# EAGLE design MCAT-CANYVAL-BOTTOM-5X (EAGLE 7.2.0)
DATECODE: 20150302102847; REV: 5X
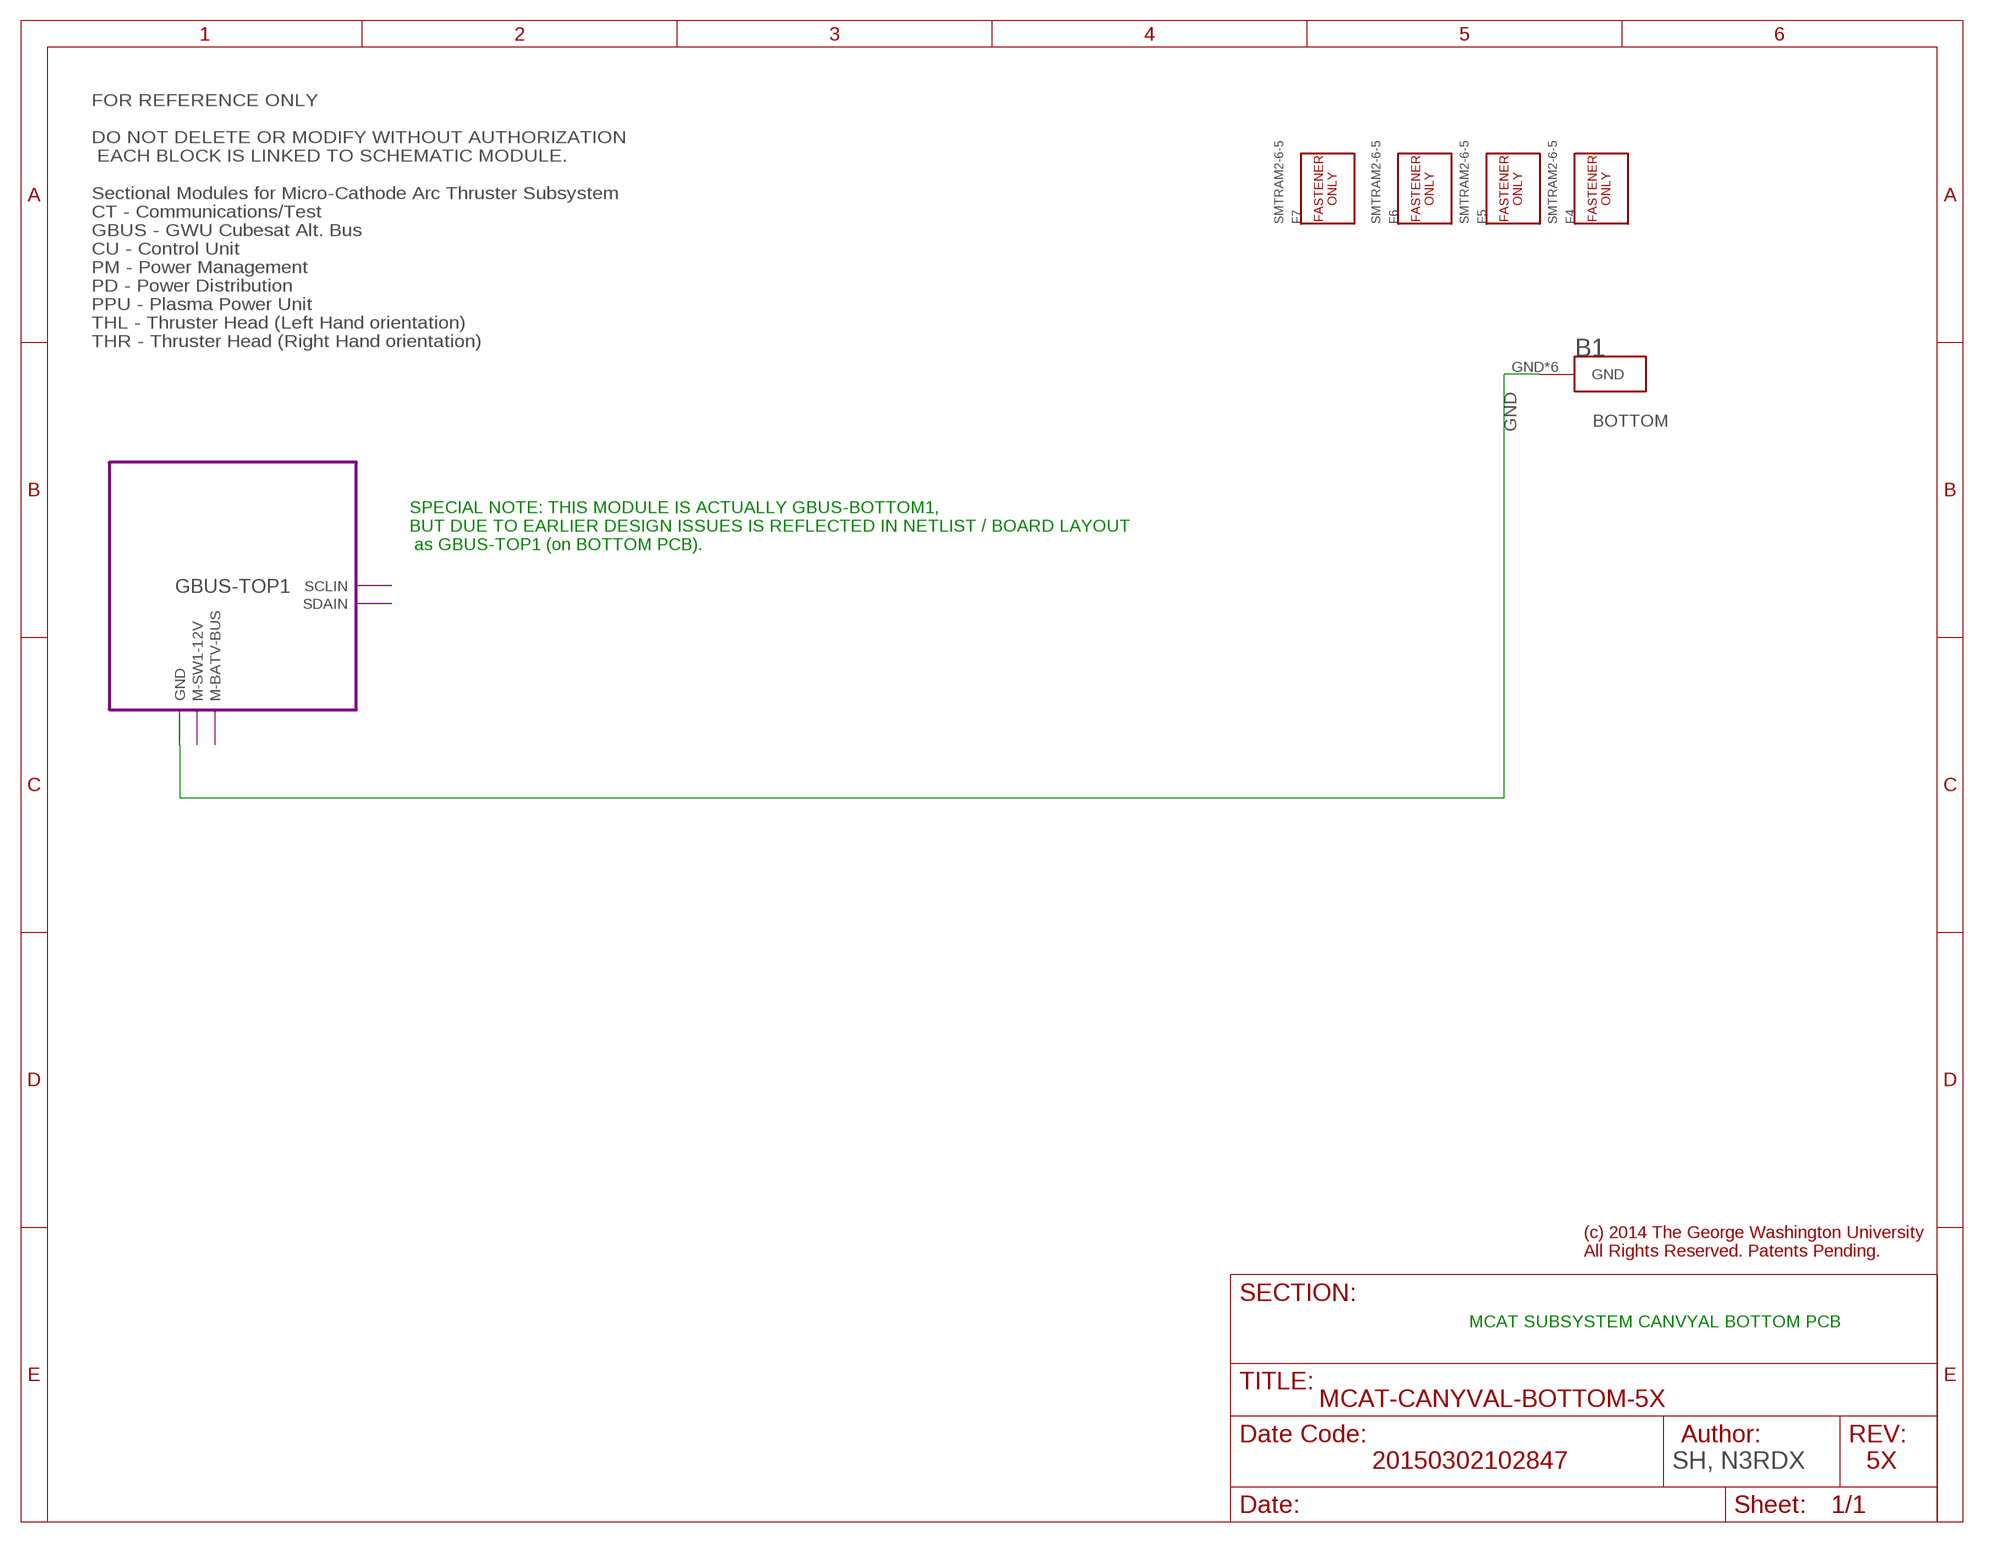
[diagram p0: schematic, sheet 1]

## Parts
B1  MCAT-4CU-C-PCB/BOTTOM  [MCAT-4CU-C-BOTTOM-V4-BLANK]
F4  SMTRAM2-6-5  [SMTRA-M2-6-5]
F5  SMTRAM2-6-5  [SMTRA-M2-6-5]
F6  SMTRAM2-6-5  [SMTRA-M2-6-5]
F7  SMTRAM2-6-5  [SMTRA-M2-6-5]

## Module instances
GBUS-TOP1 = GBUS-BOTTOM

## Nets
GND [3 A]: B1.GND B1.GND@1(GND) B1.GND@2(GND) B1.GND@3(GND) B1.GND@4(GND) B1.GND@13(GND) ; port GBUS-TOP1.GND

## Notes on the sheet
- FOR REFERENCE ONLY
  
  DO NOT DELETE OR MODIFY WITHOUT AUTHORIZATION
   EACH BLOCK IS LINKED TO SCHEMATIC MODULE.
  
  Sectional Modules for Micro-Cathode Arc Thruster Subsystem
  CT - Communications/Test
  GBUS - GWU Cubesat Alt. Bus
  CU - Control Unit
  PM - Power Management
  PD - Power Distribution
  PPU - Plasma Power Unit
  THL - Thruster Head (Left Hand orientation)
  THR - Thruster Head (Right Hand orientation)
- SPECIAL NOTE: THIS MODULE IS ACTUALLY GBUS-BOTTOM1, 
  BUT DUE TO EARLIER DESIGN ISSUES IS REFLECTED IN NETLIST / BOARD LAYOUT
   as GBUS-TOP1 (on BOTTOM PCB).
- MCAT SUBSYSTEM CANVYAL BOTTOM PCB
- SH, N3RDX

## Library data of the parts
B1 = gwu_mpnl_ucat_v10:MCAT-4CU-C-PCB; COPYRIGHT: (c) 2015, THE GEORGE WASHINGTON UNIVERSITY; PCBLABEL: BOTTOM
F4-F7 = gwu_mpnl_ucat_v10:SMTRA: Type SMTRA - ReelFast Surface Mount Right Angle (R'ANGLE) Fastener (Metric); MF: Penn Engineering; MPN: SMTRAM2-6-5-DT

## Module GBUS-BOTTOM
Ports: SCLIN(io) SDAIN(io) M-SW1-12V(io) M-BATV-BUS(io) GND(io)
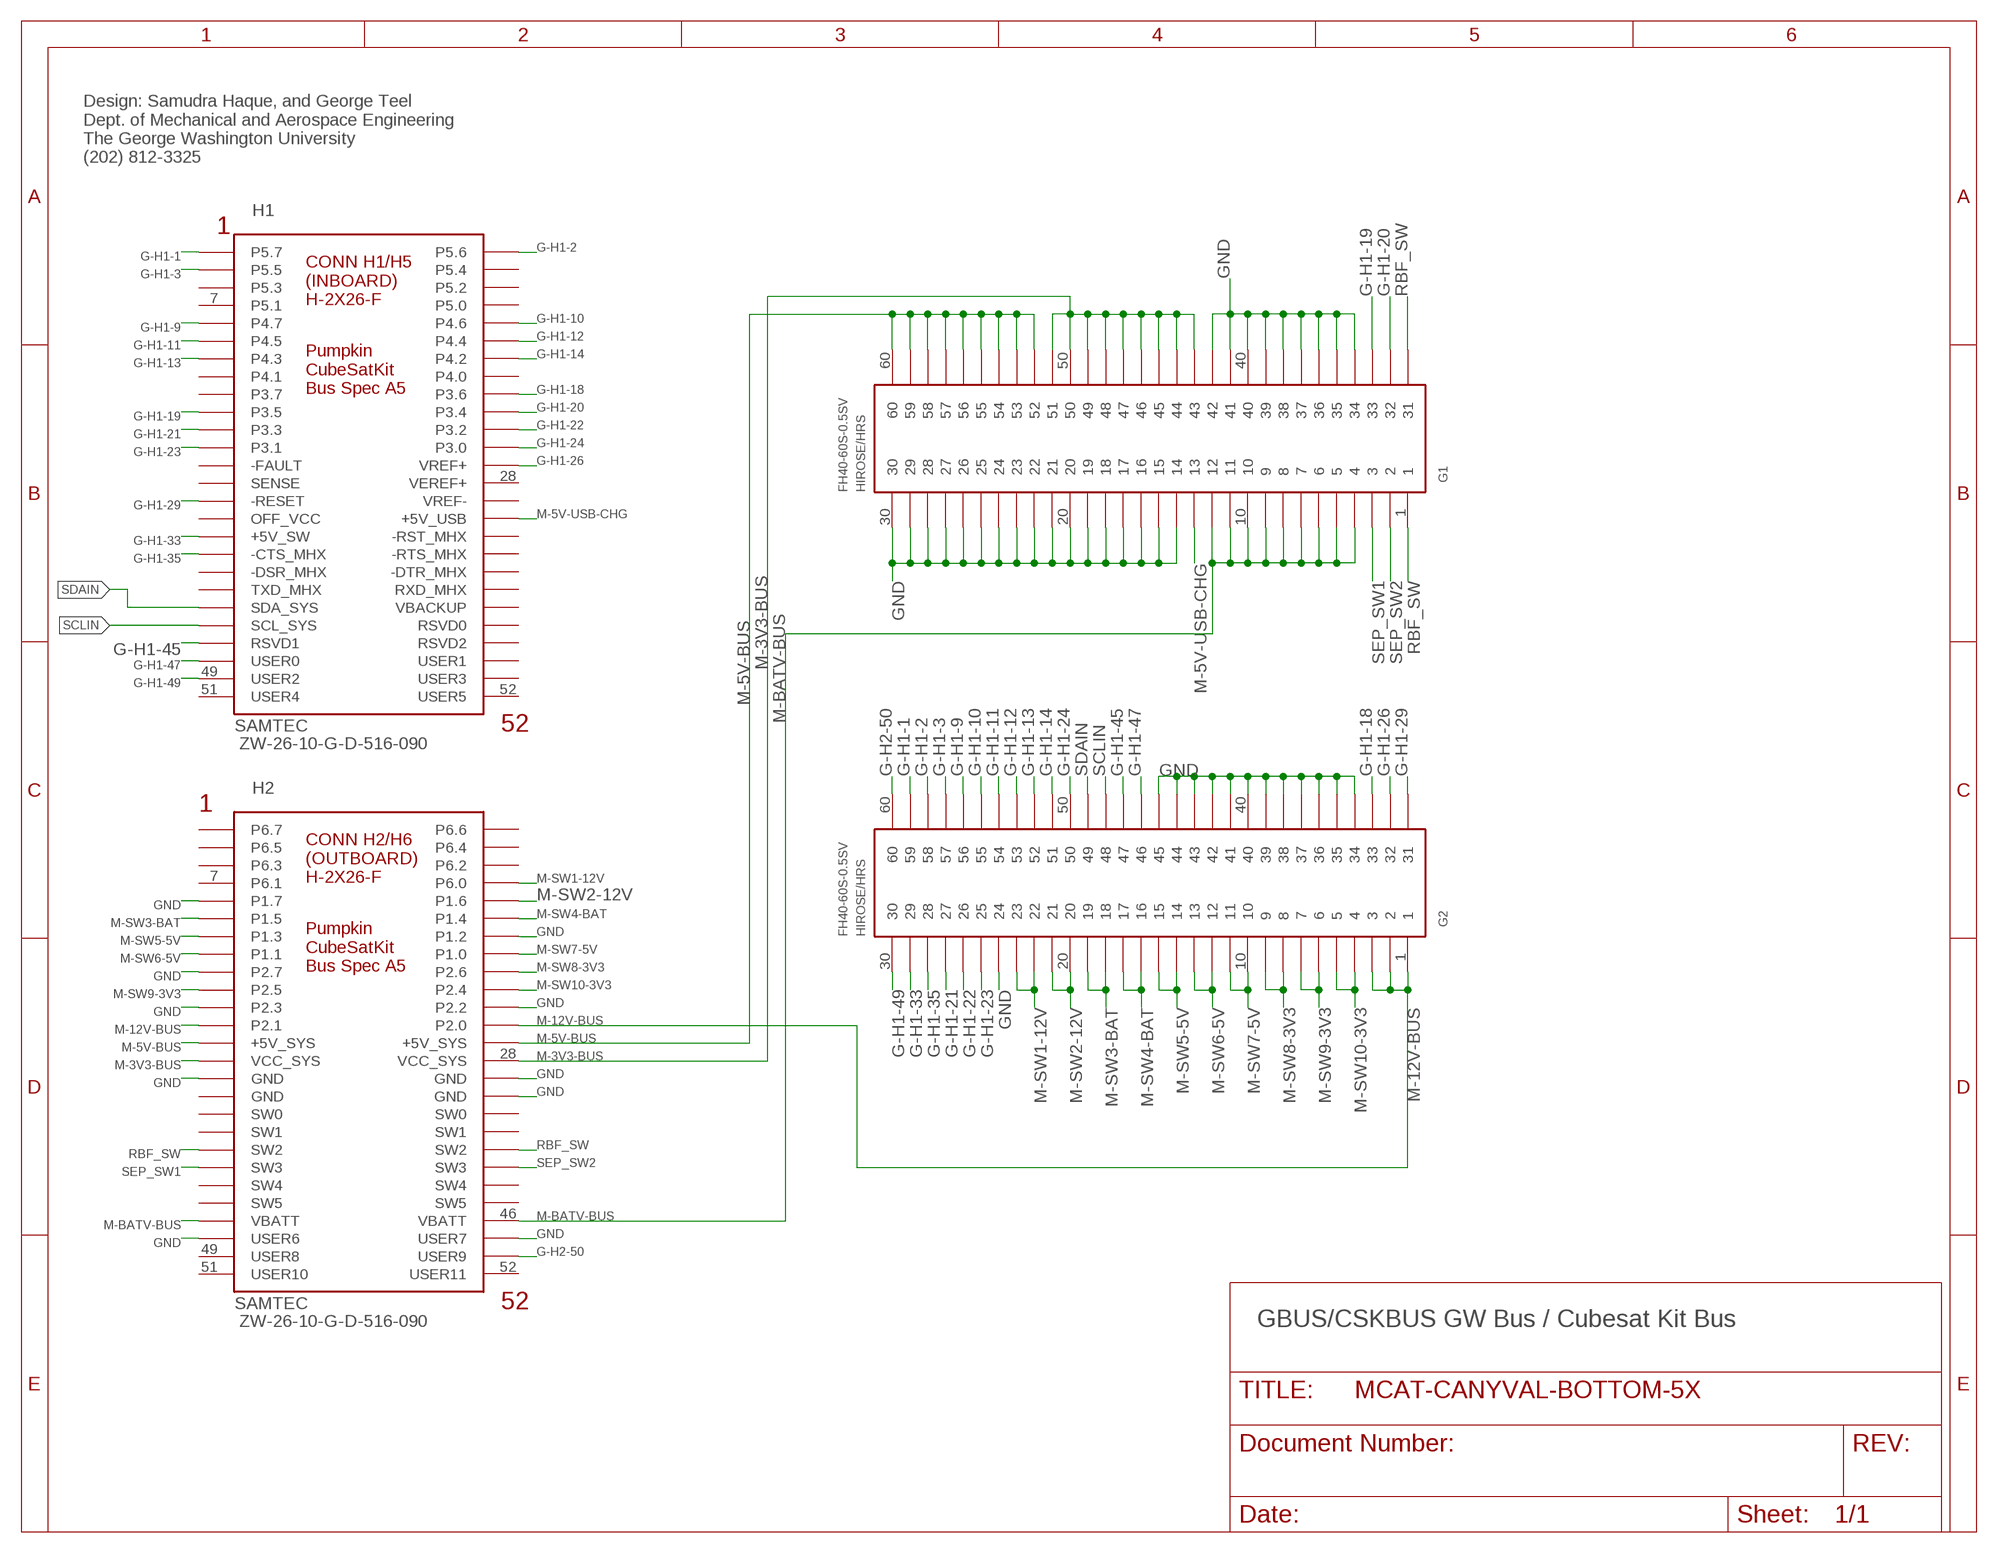
[diagram p1: schematic, module GBUS-BOTTOM, sheet 1]

### Parts
G1  HIROSE-FH40-60S-0.5SV  [HIROSE-FH40-60S-0.5SV]
G2  HIROSE-FH40-60S-0.5SV  [HIROSE-FH40-60S-0.5SV]
H1  H1-H5-INBOARD-CSK-BUS-CONN  [CONN-2X26X0.1-HDR]
H2  H2-H6-OUTBOARD-CSK-BUS-CONN  [CONN-2X26X0.1-HDR]

### Nets
G-H1-1 [1 A]: G2.59 H1.1(P5.7)
G-H1-2 [1 A]: G2.58 H1.2(P5.6)
G-H1-3 [1 A]: G2.57 H1.3(P5.5)
G-H1-9 [1 A]: G2.56 H1.9(P4.7)
G-H1-10 [1 A]: G2.55 H1.10(P4.6)
G-H1-11 [1 A]: G2.54 H1.11(P4.5)
G-H1-12 [1 A]: G2.53 H1.12(P4.4)
G-H1-13 [1 A]: G2.52 H1.13(P4.3)
G-H1-14 [1 A]: G2.51 H1.14(P4.2)
G-H1-18: G2.33 H1.18(P3.6)
G-H1-19 [1 A]: G1.33 H1.19(P3.5)
G-H1-20 [1 A]: G1.32 H1.20(P3.4)
G-H1-21 [1 A]: G2.27 H1.21(P3.3)
G-H1-22 [1 A]: G2.26 H1.22(P3.2)
G-H1-23 [1 A]: G2.25 H1.23(P3.1)
G-H1-24 [1 A]: G2.50 H1.24(P3.0)
G-H1-26: G2.32 H1.26(VREF+)
G-H1-29: G2.31 H1.29(-RESET)
G-H1-33 [1 A]: G2.29 H1.33(+5V_SW)
G-H1-35 [1 A]: G2.28 H1.35(-CTS_MHX)
G-H1-45 [1 A]: G2.47 H1.45(RSVD1)
G-H1-47 [1 A]: G2.46 H1.47(USER0)
G-H1-49 [1 A]: G2.30 H1.49(USER2)
G-H2-50 [1 A]: G2.60 H2.50(USER9)
GND: G1.14 G1.15 G1.16 G1.17 G1.18 G1.19 G1.20 G1.21 G1.22 G1.23 G1.24 G1.25 G1.26 G1.27 G1.28 G1.29 G1.30 G1.34 G1.35 G1.36 G1.37 G1.38 G1.39 G1.40 G1.41 G1.42 G2.24 G2.34 G2.35 G2.36 G2.37 G2.38 G2.39 G2.40 G2.41 G2.42 G2.43 G2.44 G2.45 H2.9(P1.7) H2.14(P1.2) H2.17(P2.7) H2.21(P2.3) H2.22(P2.2) H2.29(GND) H2.30(GND) H2.32(GND) H2.47(USER6) H2.48(USER7)
M-3V3-BUS [3 A]: G1.43 G1.44 G1.45 G1.46 G1.47 G1.48 G1.49 G1.50 G1.51 H2.27(VCC_SYS) H2.28(VCC_SYS)
M-5V-BUS [3 A]: G1.52 G1.53 G1.54 G1.55 G1.56 G1.57 G1.58 G1.59 G1.60 H2.25(+5V_SYS) H2.26(+5V_SYS)
M-5V-USB-CHG: G1.13 H1.32(+5V_USB)
M-12V-BUS [2 A]: G2.1 G2.2 G2.3 H2.23(P2.1) H2.24(P2.0)
M-BATV-BUS [3 A]: G1.4 G1.5 G1.6 G1.7 G1.8 G1.9 G1.10 G1.11 G1.12 H2.45(VBATT) H2.46(VBATT)
M-SW1-12V [1 A]: G2.22 G2.23 H2.8(P6.0)
M-SW2-12V [1 A]: G2.20 G2.21 H2.10(P1.6)
M-SW3-BAT [1 A]: G2.18 G2.19 H2.11(P1.5)
M-SW4-BAT [1 A]: G2.16 G2.17 H2.12(P1.4)
M-SW5-5V [1 A]: G2.14 G2.15 H2.13(P1.3)
M-SW6-5V [1 A]: G2.12 G2.13 H2.15(P1.1)
M-SW7-5V [1 A]: G2.10 G2.11 H2.16(P1.0)
M-SW8-3V3 [1 A]: G2.8 G2.9 H2.18(P2.6)
M-SW9-3V3 [1 A]: G2.6 G2.7 H2.19(P2.5)
M-SW10-3V3 [1 A]: G2.4 G2.5 H2.20(P2.4)
RBF_SW [1 A]: G1.1 G1.31 H2.37(SW2) H2.38(SW2)
SCLIN [1 A]: G2.48 H1.43(SCL_SYS)
SDAIN [1 A]: G2.49 H1.41(SDA_SYS)
SEP_SW1 [1 A]: G1.3 H2.39(SW3)
SEP_SW2 [1 A]: G1.2 H2.40(SW3)
Unconnected: H1.4(P5.4) H1.5(P5.3) H1.6(P5.2) H1.7(P5.1) H1.8(P5.0) H1.15(P4.1) H1.16(P4.0) H1.17(P3.7) H1.25(-FAULT) H1.27(SENSE) H1.28(VEREF+) H1.30(VREF-) H1.31(OFF_VCC) H1.34(-RST_MHX) H1.36(-RTS_MHX) H1.37(-DSR_MHX) H1.38(-DTR_MHX) H1.39(TXD_MHX) H1.40(RXD_MHX) H1.42(VBACKUP) H1.44(RSVD0) H1.46(RSVD2) H1.48(USER1) H1.50(USER3) H1.51(USER4) H1.52(USER5) H2.1(P6.7) H2.2(P6.6) H2.3(P6.5) H2.4(P6.4) H2.5(P6.3) H2.6(P6.2) H2.7(P6.1) H2.31(GND) H2.33(SW0) H2.34(SW0) H2.35(SW1) H2.36(SW1) H2.41(SW4) H2.42(SW4) H2.43(SW5) H2.44(SW5) H2.49(USER8) H2.51(USER10) H2.52(USER11)

### Notes on the sheet
- Design: Samudra Haque, and George Teel
  Dept. of Mechanical and Aerospace Engineering
  The George Washington University
  (202) 812-3325
- GBUS/CSKBUS GW Bus / Cubesat Kit Bus

### Library data of the parts
G1 = gwu_mpnl_ucat_v10:HIROSE-FH40-60S-0.5SV; MF: HIROSE/HRS; MPN: FH40-60S-0.5SV; PCBLABEL: G1
G2 = gwu_mpnl_ucat_v10:HIROSE-FH40-60S-0.5SV; MF: HIROSE/HRS; MPN: FH40-60S-0.5SV; PCBLABEL: G2
H1 = gwu_mpnl_ucat_v10:H1-H5-INBOARD-CSK-BUS-CONN: H1/H5/Inboard Cubesat Kit Bus Connector 1 x Samtec ESQ-126-39-G-D Connectors 104 pins per Cubesat Kit Bus Spec A5 Place H1/H5 (Inboard) conn. pin #1 at 3.275"x0.550" exactly. Pins 1-52; MF: SAMTEC; MPN: ZW-26-10-G-D-516-090; PCBLABEL: H1
H2 = gwu_mpnl_ucat_v10:H2-H6-OUTBOARD-CSK-BUS-CONN; MF: SAMTEC; MPN: ZW-26-10-G-D-516-090; PCBLABEL: H2

## Net classes
1 vout1a2ozcu: width 0.406 mm
2 VOUTA-2A-CKT: width 1.016 mm
3 P3-0.5A-CKT: width 0.254 mm
5 25 mA: width 0.002 mm
6 0.1 A: width 0.011 mm
7 0.25 A: width 0.039 mm
8 0.5 A: width 0.101 mm
9 1 A: width 0.263 mm
10 2 A: width 0.685 mm
11 3 A: width 1.199 mm

## Board
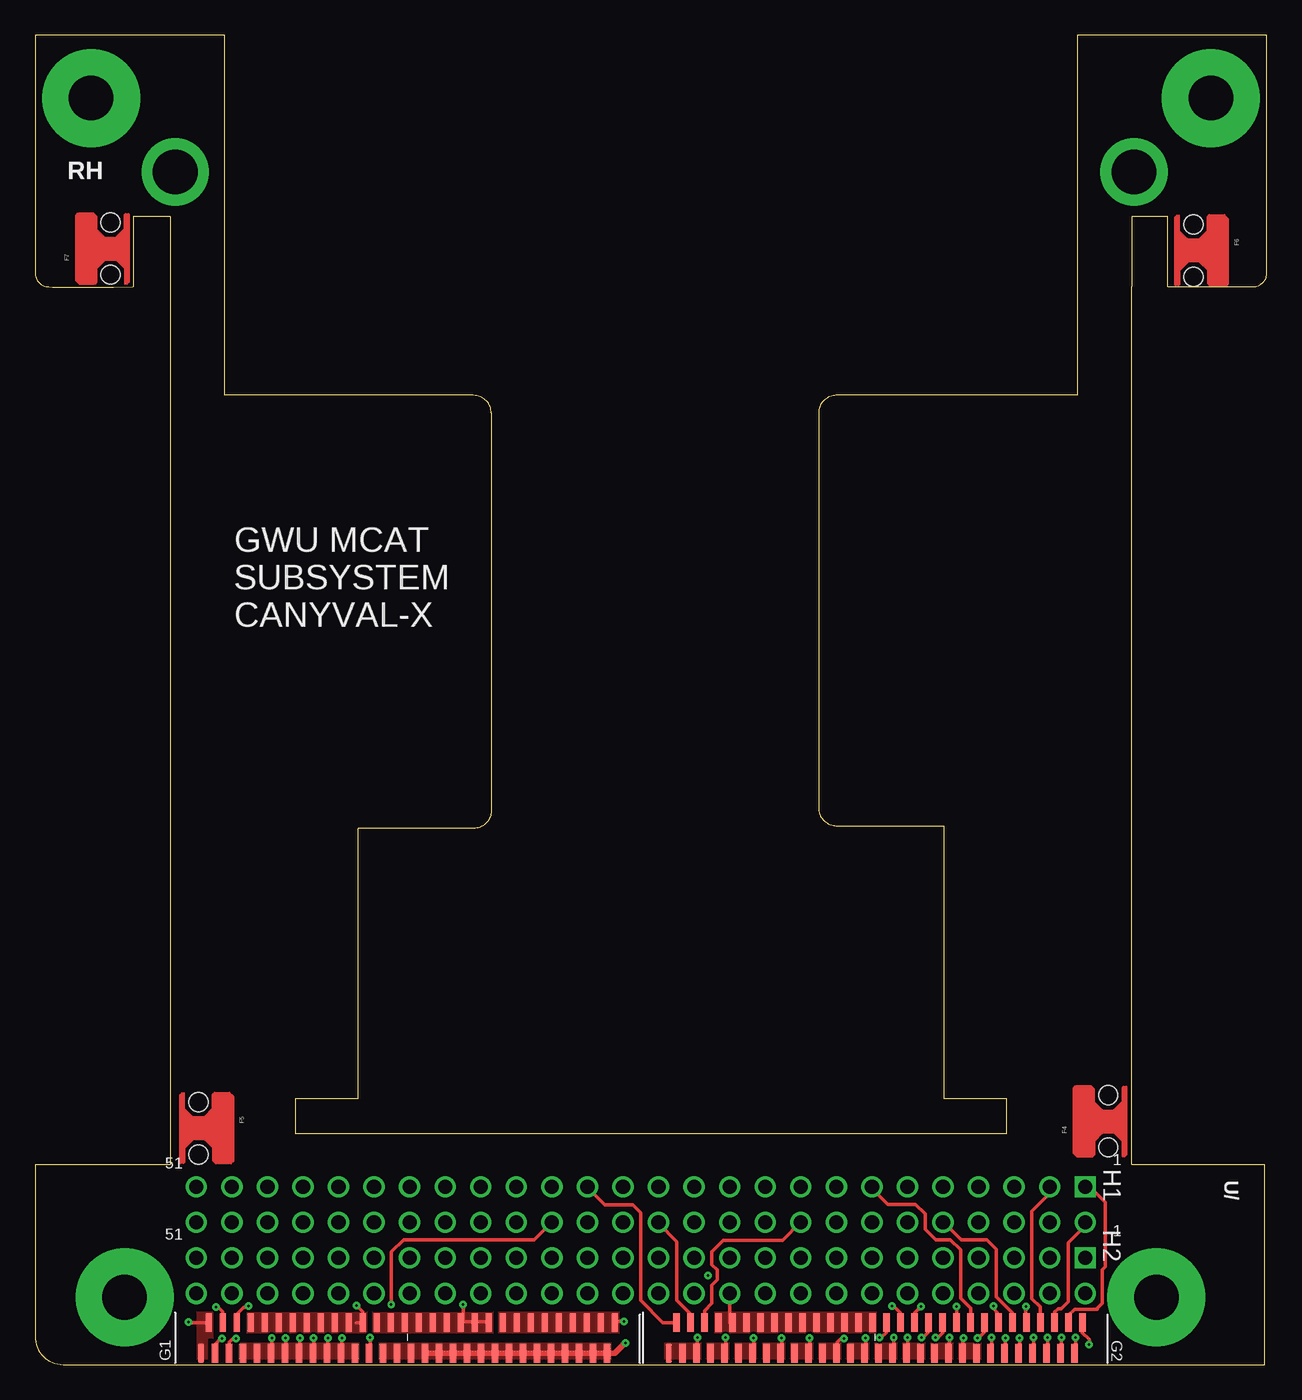
[diagram p2: board, top side]
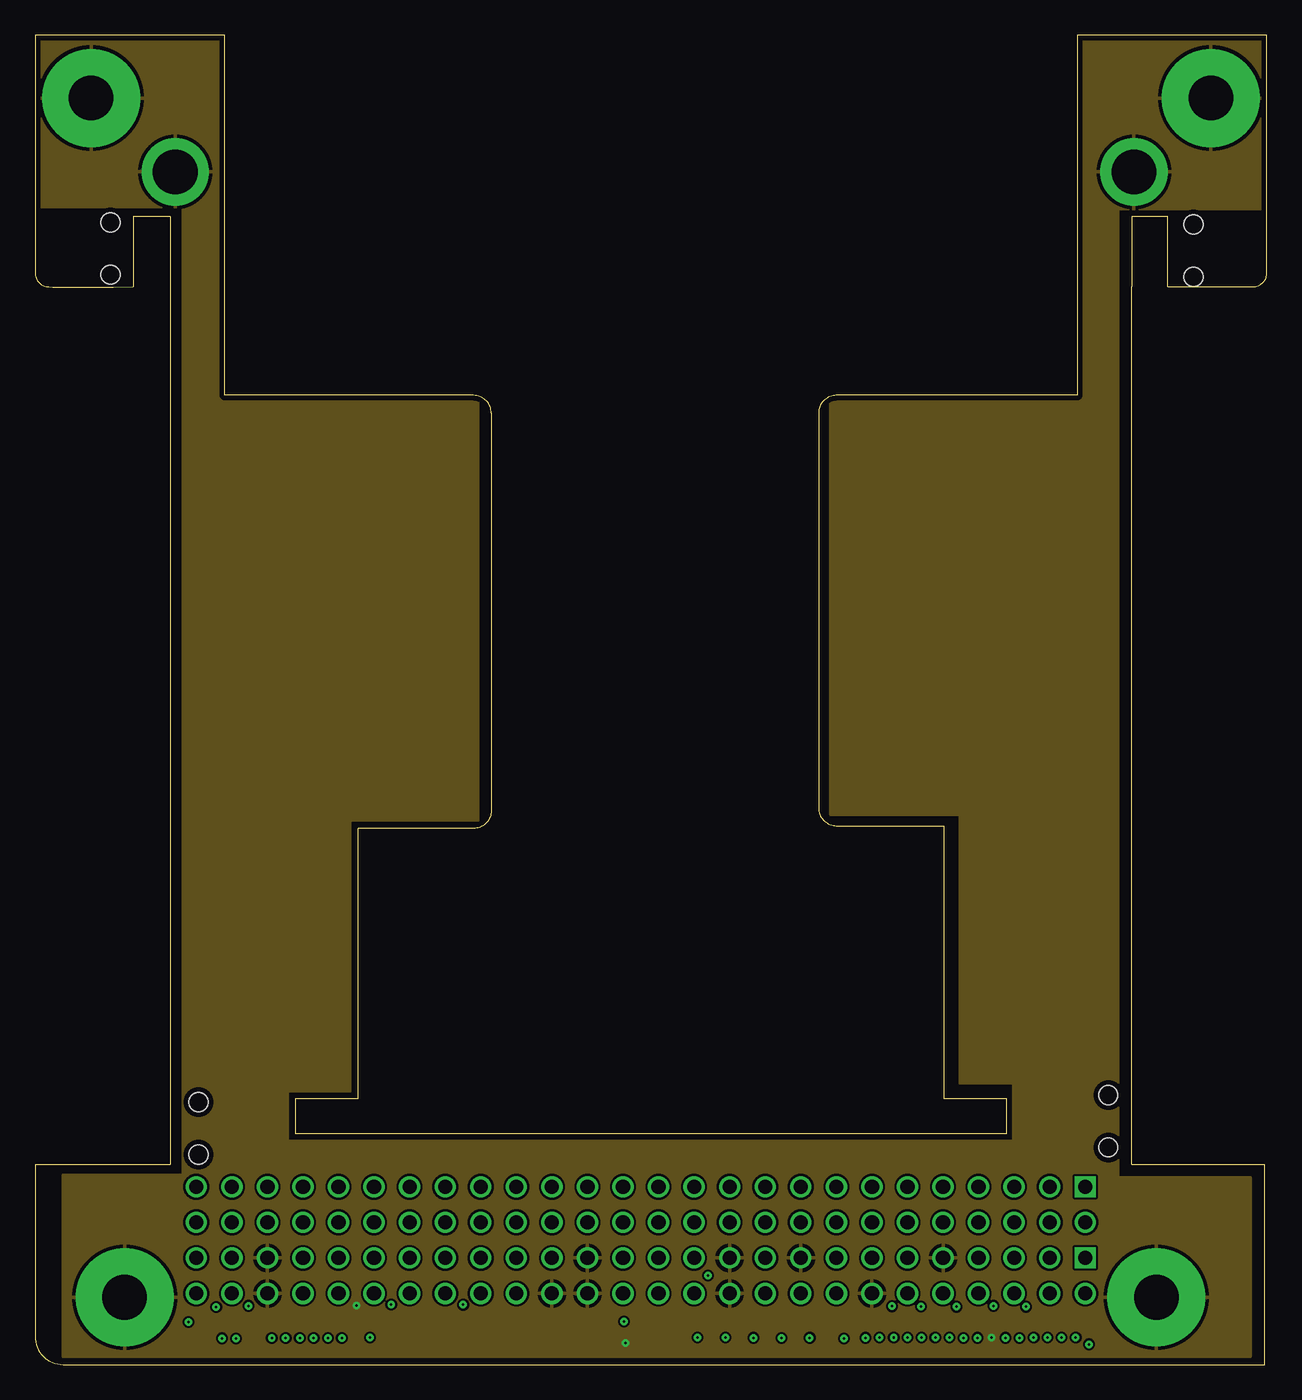
[diagram p3: board, inner layer L2/TopGround]
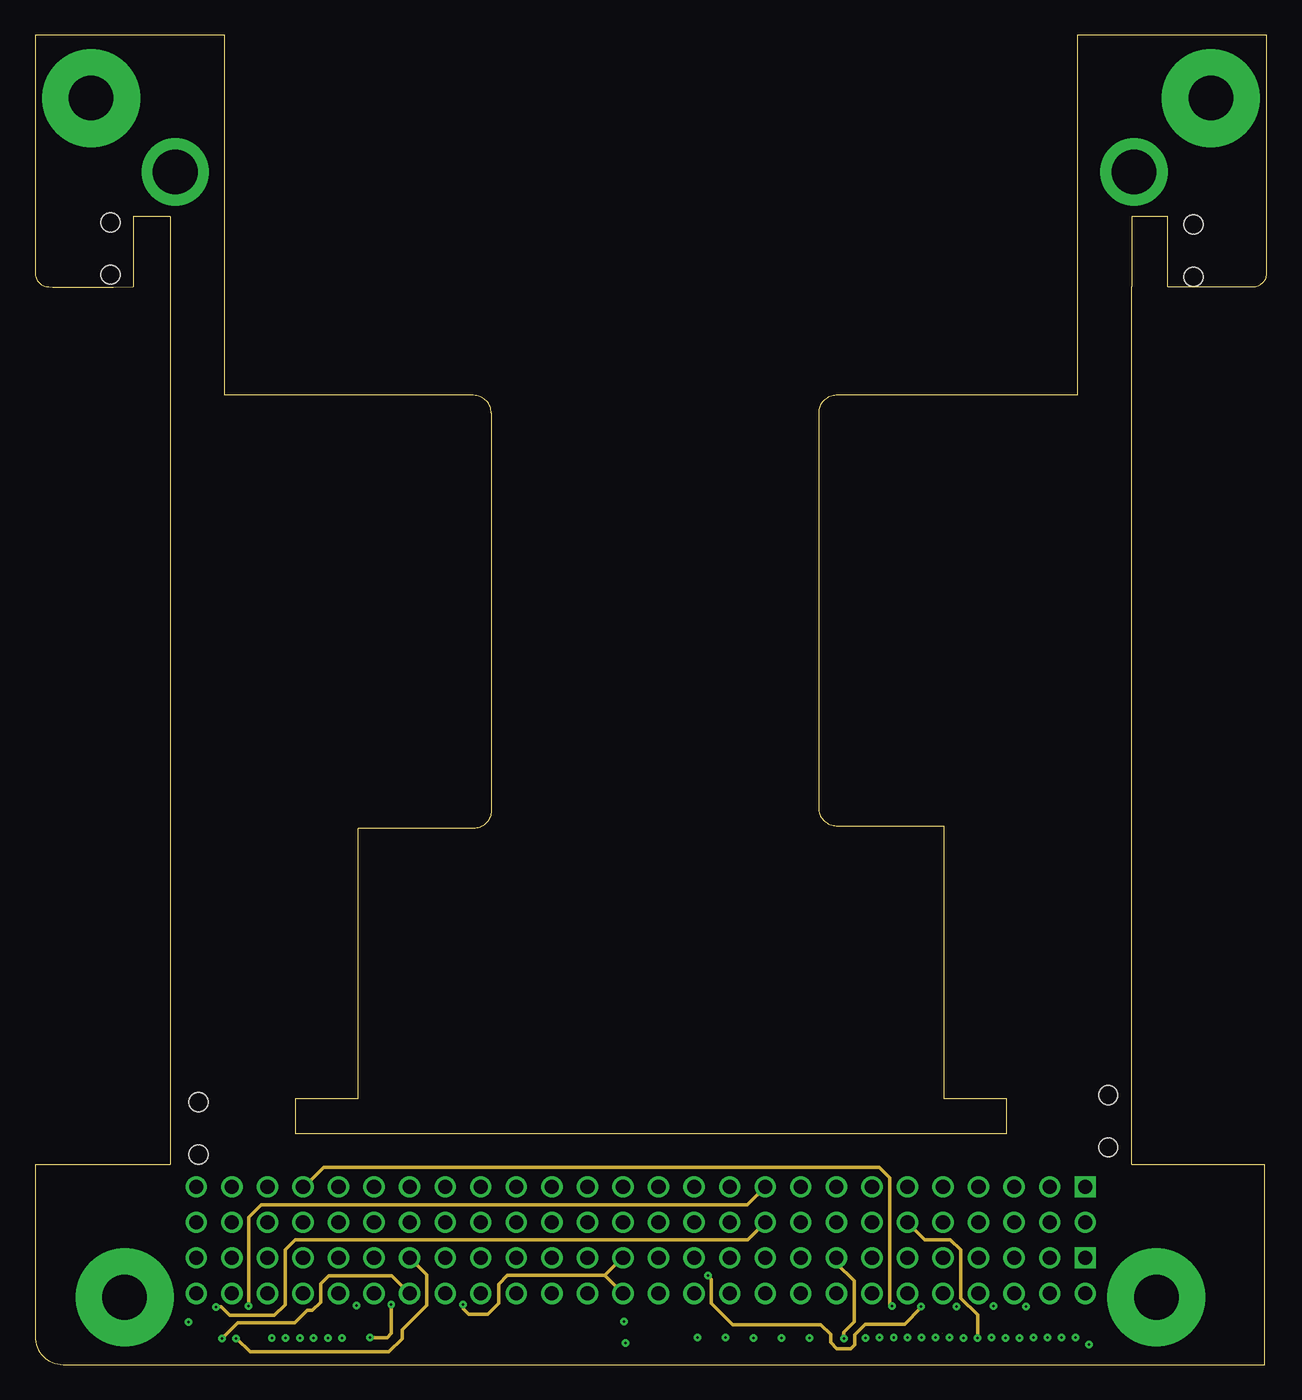
[diagram p4: board, inner layer L3/Power1]
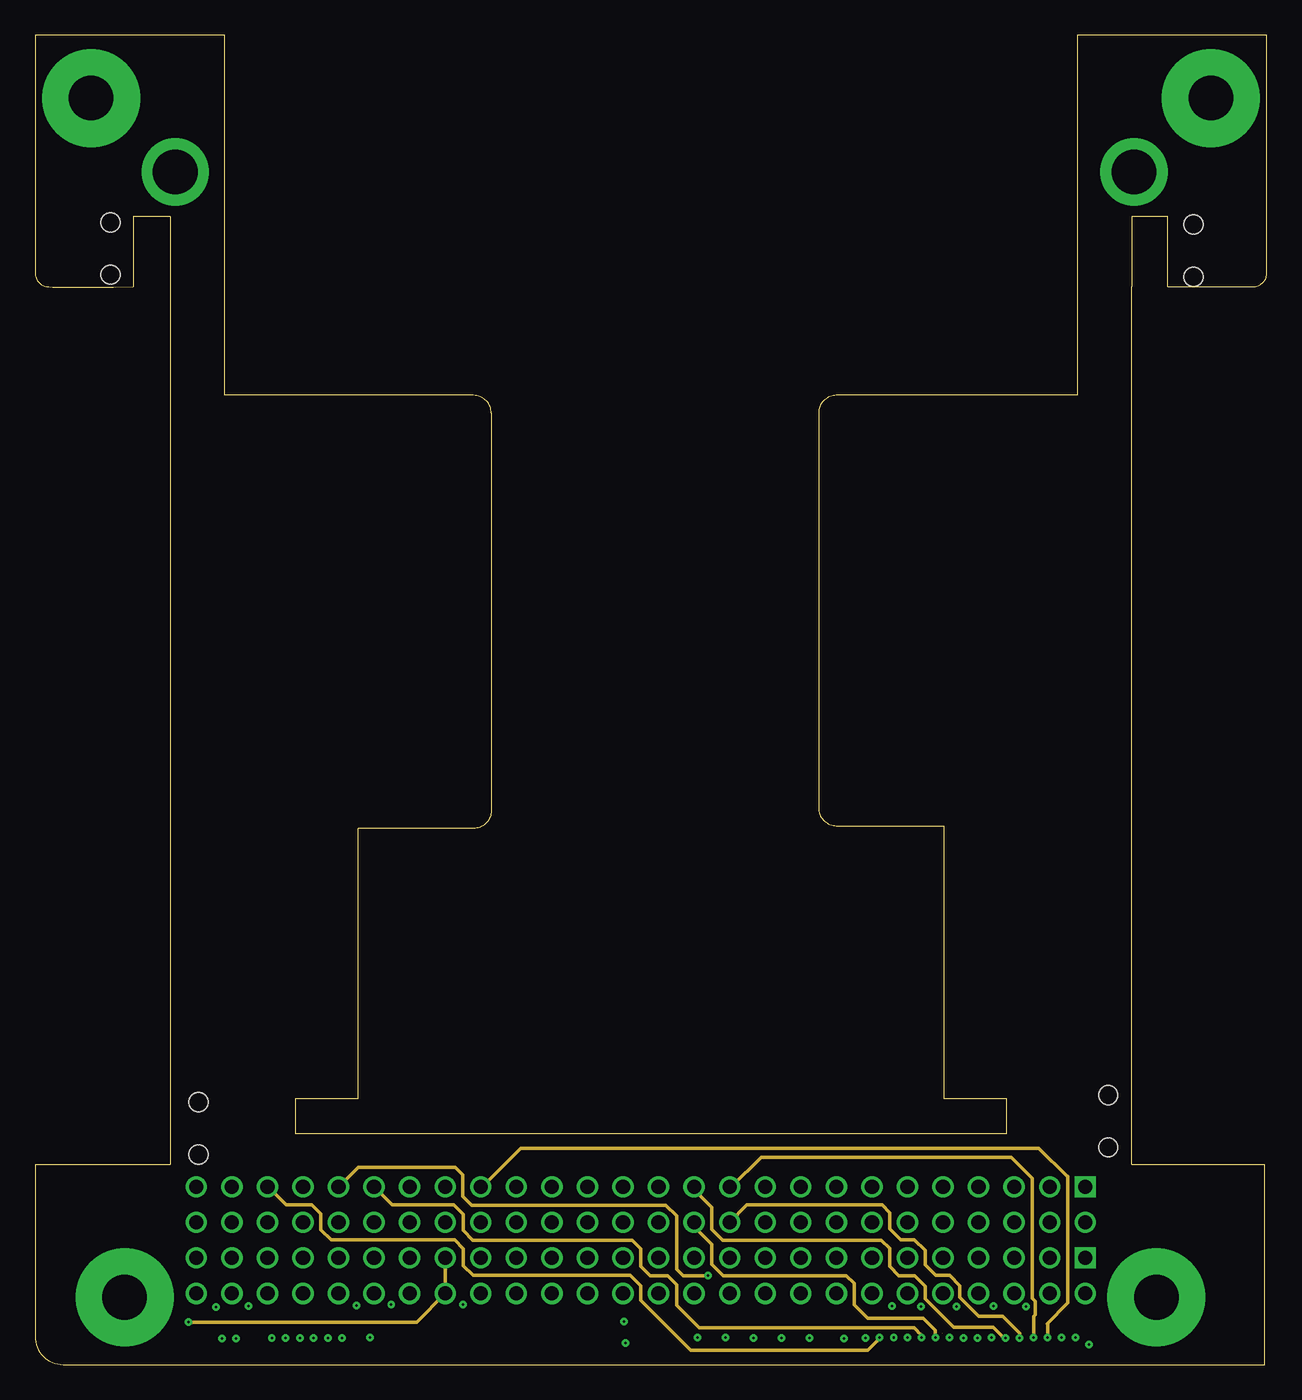
[diagram p5: board, inner layer L14/Power2]
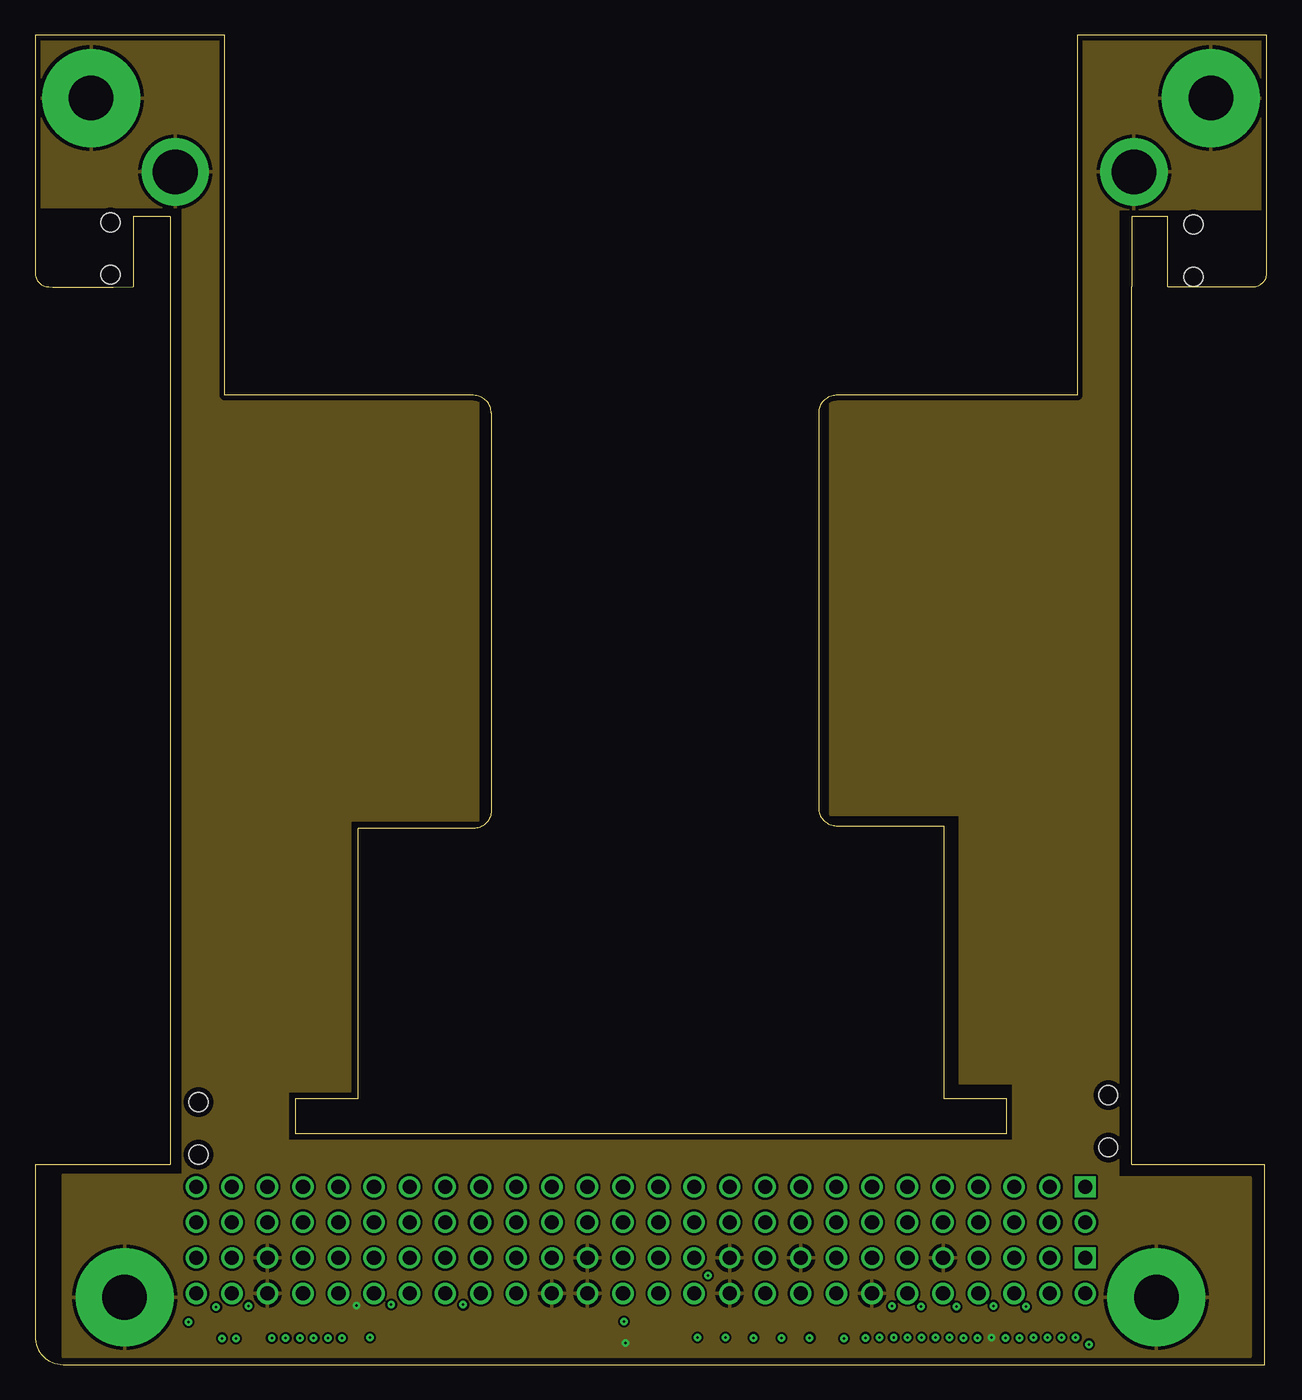
[diagram p6: board, inner layer L15/BottomGround]
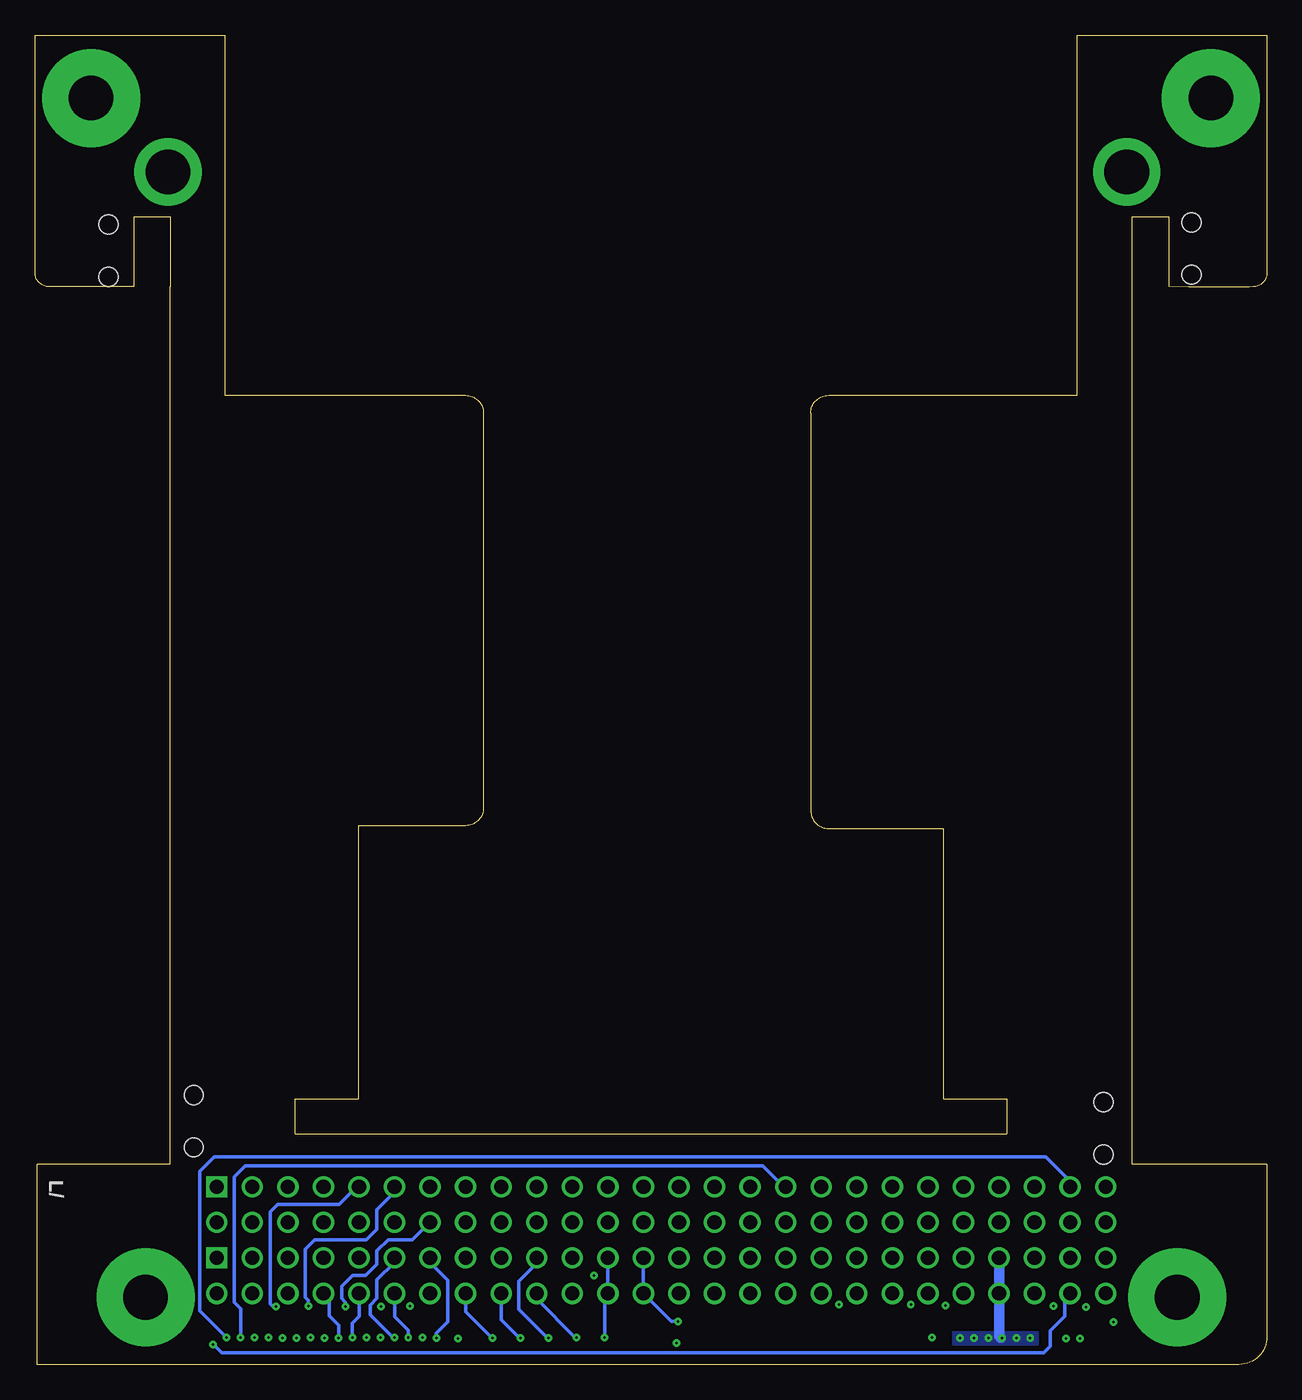
[diagram p7: board, bottom side, seen from below]

Size 88 x 95 mm. Coordinates in mm from the lower left corner, seen from the top.
Copper layers (1+2*3+14*15+16): L1/TopSignal 0.035559375mm / dielectric 3.5mil / L2/TopGround 0.01778125mm / dielectric 47mil / L3/Power1 0.0356mm / dielectric 12mil / L14/Power2 0.0356mm / dielectric 0.1499mm / L15/BottomGround 0.01778125mm / dielectric 3.5mil / L16/BottomSignal 0.035559375mm
Design rules "mcat-4cu-c *": minimum track width 2mil, minimum drill 8mil, track to track 6mil, track to pad 6mil, pad to pad 6mil, via to via 6mil, smd to smd 6mil, copper to edge 15mil, drill to drill 5mil, minimum pad ring 8mil, minimum via ring 4mil, stop-mask expansion 0mil, vias tented up to drill 8mil, thermal gap 10mil

### Footprints (pad centres in the part's own frame; a part is rotated, then mirrored left to right if it is on the bottom)
MCAT-4CU-C-BOTTOM-V4-BLANK = drill 3.2: GND -10.49,85.22; GND@13 -78.97,85.22 | drill 3.2 pad 7: GND@1 -8.89,4.8; GND@2 -82.59,4.8; GND@3 -84.99,90.5; GND@4 -4.99,90.5
SMTRA-M2-6-5 = hole 1.35: -1.869,0; 1.869,0
HIROSE-FH40-60S-0.5SV = smd 0.455 x 1.35: 1 0,0; 2 -1,0; 3 -2,0; 4 -3,0; 5 -4,0; 6 -5,0; 7 -6,0; 8 -7,0; 9 -8,0; 10 -9,0; 11 -10,0; 12 -11,0; 13 -12,0; 14 -13,0; 15 -14,0; 16 -15,0; 17 -16,0; 18 -17,0; 19 -18,0; 20 -19,0; 21 -20,0; 22 -21,0; 23 -22,0; 24 -23,0; 25 -24,0; 26 -25,0; 27 -26,0; 28 -27,0; 29 -28,0; 30 -29,0; 31 -0.554,-2.198; 32 -1.554,-2.198; 33 -2.554,-2.198; 34 -3.554,-2.198; 35 -4.554,-2.198; 36 -5.554,-2.198; 37 -6.554,-2.198; 38 -7.554,-2.198; 39 -8.554,-2.198; 40 -9.554,-2.198; 41 -10.554,-2.198; 42 -11.554,-2.198; 43 -12.554,-2.198; 44 -13.554,-2.198; 45 -14.554,-2.198; 46 -15.554,-2.198; 47 -16.554,-2.198; 48 -17.554,-2.198; 49 -18.554,-2.198; 50 -19.554,-2.198; 51 -20.554,-2.198; 52 -21.554,-2.198; 53 -22.554,-2.198; 54 -23.554,-2.198; 55 -24.554,-2.198; 56 -25.554,-2.198; 57 -26.554,-2.198; 58 -27.554,-2.198; 59 -28.554,-2.198; 60 -29.554,-2.198
CONN-2X26X0.1-HDR = drill 1.016 pad 1.524 square: 1 0,0 | drill 1.016 pad 1.524: 2 0,2.54; 3 2.54,0; 4 2.54,2.54; 5 5.08,0; 6 5.08,2.54; 7 7.62,0; 8 7.62,2.54; 9 10.16,0; 10 10.16,2.54; 11 12.7,0; 12 12.7,2.54; 13 15.24,0; 14 15.24,2.54; 15 17.78,0; 16 17.78,2.54; 17 20.32,0; 18 20.32,2.54; 19 22.86,0; 20 22.86,2.54; 21 25.4,0; 22 25.4,2.54; 23 27.94,0; 24 27.94,2.54; 25 30.48,0; 26 30.48,2.54; 27 33.02,0; 28 33.02,2.54; 29 35.56,0; 30 35.56,2.54; 31 38.1,0; 32 38.1,2.54; 33 40.64,0; 34 40.64,2.54; 35 43.18,0; 36 43.18,2.54; 37 45.72,0; 38 45.72,2.54; 39 48.26,0; 40 48.26,2.54; 41 50.8,0; 42 50.8,2.54; 43 53.34,0; 44 53.34,2.54; 45 55.88,0; 46 55.88,2.54; 47 58.42,0; 48 58.42,2.54; 49 60.96,0; 50 60.96,2.54; 51 63.5,0; 52 63.5,2.54

### Placement (x,y rotation side)
B1  88.99,0 0 top
F4  76.67,17.38 90 top
F5  11.68,16.87 270 top
F6  82.74,79.59 270 top
F7  5.4,79.74 90 top
GBUS-TOP1:G1  HIROSE-FH40-60S-0.5SV  [HIROSE-FH40-60S-0.5SV]  11.86,0.8 180 top
GBUS-TOP1:G2  HIROSE-FH40-60S-0.5SV  [HIROSE-FH40-60S-0.5SV]  45.26,0.8 180 top
GBUS-TOP1:H1  H1-H5-INBOARD-CSK-BUS-CONN  [CONN-2X26X0.1-HDR]  75.02,12.7 180 top
GBUS-TOP1:H2  H2-H6-OUTBOARD-CSK-BUS-CONN  [CONN-2X26X0.1-HDR]  75.02,7.62 180 top

### Tracks (layer width: path | path; a pad name or v marks a point on that pad's centre or on a via)
GBUS-TOP1:G-H1-1
  L1/TopSignal 0.254: 73.79,3.02 GBUS-TOP1:G2.59 73.82,3.51 74.27,3.96 75.88,3.96 75.88,4.01 76.23,4.37 76.23,6.78 76.44,6.98 76.44,11.59 75.33,12.7 GBUS-TOP1:H1.1
GBUS-TOP1:G-H1-2
  L1/TopSignal 0.254: GBUS-TOP1:G2.58 72.84,3.02 72.84,3.76 73.08,4 73.31,4 73.79,4.48 73.79,8.68 75.02,9.91 GBUS-TOP1:H1.2
GBUS-TOP1:G-H1-3
  L1/TopSignal 0.254: GBUS-TOP1:G2.57 71.8,3.01 71.8,3.79 71.79,3.8 71.79,4.12 71.21,4.69 71.21,10.95 72.48,12.22 GBUS-TOP1:H1.3
GBUS-TOP1:G-H1-9  (via drill 0.18 pad 0.53)
  L1/TopSignal 0.254: GBUS-TOP1:G2.56 70.78,3.03 v70.78,4.13
  L16/BottomSignal 0.254: GBUS-TOP1:H1.9 65.01,12.7 66.25,11.46 70.67,11.46 71.21,10.91 71.21,4.36 70.98,4.13 v70.78,4.13
GBUS-TOP1:G-H1-10
  L1/TopSignal 0.254: GBUS-TOP1:G2.55 69.79,3.02 69.81,3.04 69.81,3.68 68.65,4.84 68.65,8.25 67.99,8.91 66.15,8.91 64.9,10.16 GBUS-TOP1:H1.10
GBUS-TOP1:G-H1-11  (via drill 0.18 pad 0.53)
  L1/TopSignal 0.254: GBUS-TOP1:G2.54 68.74,3.07 68.74,3.7 68.47,3.98 v68.47,4.19
  L16/BottomSignal 0.254: GBUS-TOP1:H1.11 62.32,12.32 63.6,11.04 63.6,9.65 64.35,8.9 68.03,8.9 68.69,8.24 68.69,4.8 68.47,4.58 v68.47,4.19
GBUS-TOP1:G-H1-12  (via drill 0.18 pad 0.53)
  L1/TopSignal 0.254: 67.85,3.03 GBUS-TOP1:G2.53 67.8,2.98 67.8,2.31 67.4,1.91 v67.33,1.91
  L3/Power1 0.254: GBUS-TOP1:H1.12 63.56,8.91 63.57,8.91 65.39,8.91 66.12,8.18 66.12,4.75 67.33,3.55 v67.33,1.91
GBUS-TOP1:G-H1-13
  L1/TopSignal 0.254: GBUS-TOP1:G2.52 66.83,3.01 66.83,3.83 66.84,3.84 66.84,4.01 66.11,4.74 66.11,8.18 65.39,8.9 64.33,8.9 63.59,9.65 63.59,10.76 62.89,11.46 60.91,11.46 59.78,12.59 GBUS-TOP1:H1.13
GBUS-TOP1:G-H1-14  (via drill 0.18 pad 0.53)
  L1/TopSignal 0.254: GBUS-TOP1:G2.51 v65.83,4.13
  L16/BottomSignal 0.254: GBUS-TOP1:H1.14 59.81,10.16 61.05,8.92 62.78,8.92 63.58,8.12 63.58,7.17 64.36,6.38 65.31,6.38 66.1,5.59 66.1,4.72 65.83,4.45 v65.83,4.13
GBUS-TOP1:G-H1-18
  L1/TopSignal 0.254: GBUS-TOP1:G2.33 47.83,3.85 48.35,4.37 48.35,5.67 48.73,6.04 48.73,6.76 48.34,7.14 48.34,8.07 49.17,8.89 53.41,8.89 54.67,10.16 GBUS-TOP1:H1.18
GBUS-TOP1:G-H1-19  (via drill 0.18 pad 0.53)
  L1/TopSignal 0.254: v15.25,4.19 15.15,4.09 14.91,4.09 14.41,3.59 GBUS-TOP1:G1.33
  L3/Power1 0.254: GBUS-TOP1:H1.19 50.86,11.4 16.15,11.4 15.25,10.51 v15.25,4.19
GBUS-TOP1:G-H1-20  (via drill 0.18 pad 0.53)
  L1/TopSignal 0.254: GBUS-TOP1:G1.32 13.41,3.76 13.07,4.11 v12.94,4.11
  L3/Power1 0.254: GBUS-TOP1:H1.20 50.9,8.9 18.58,8.9 17.87,8.19 17.87,4.28 17.1,3.5 13.9,3.5 13.3,4.11 v12.94,4.11
GBUS-TOP1:G-H1-21  (via drill 0.18 pad 0.53)
  L1/TopSignal 0.254: GBUS-TOP1:G2.27 71.34,0.88 v71.34,1.92
  L14/Power2 0.254: GBUS-TOP1:H1.21 49.75,12.7 51.87,14.82 69.73,14.82 71.23,13.32 71.23,4.75 71.46,4.52 71.46,3.56 71.34,3.43 v71.34,1.92
GBUS-TOP1:G-H1-22  (via drill 0.18 pad 0.53)
  L1/TopSignal 0.254: GBUS-TOP1:G2.26 70.32,0.86 v70.32,1.9
  L14/Power2 0.254: GBUS-TOP1:H1.22 49.62,10.17 50.85,11.4 60.51,11.4 61.06,10.85 61.06,9.69 61.83,8.92 62.82,8.92 63.58,8.16 63.58,7.14 64.35,6.37 65.34,6.37 66.06,5.64 66.06,4.79 67.42,3.43 69.12,3.43 70.32,2.23 v70.32,1.9 70.25,1.9
GBUS-TOP1:G-H1-23  (via drill 0.18 pad 0.53)
  L1/TopSignal 0.254: GBUS-TOP1:G2.25 69.31,0.85 v69.31,1.91
  L14/Power2 0.254: GBUS-TOP1:H1.23 47.08,12.49 48.35,11.23 48.35,9.64 49.11,8.88 60.46,8.88 61.06,8.29 61.06,7 61.7,6.35 62.83,6.35 63.59,5.6 63.59,4.69 65.62,2.66 68.43,2.66 69.19,1.91 v69.31,1.91
GBUS-TOP1:G-H1-24  (via drill 0.18 pad 0.53)  (1 unrouted)
  L1/TopSignal 0.254: GBUS-TOP1:G2.50 64.83,2.98 64.83,2.27 64.79,2.23 | 64.79,2.22 64.49,1.92 v64.31,1.92
  L14/Power2 0.254: 49.41,6.34 | 49.41,6.34 49.17,6.34 48.35,7.17 48.35,8.57 47.08,9.84 GBUS-TOP1:H1.24 | 49.41,6.34 57.95,6.34 58.5,5.79 58.5,4.27 59.47,3.3 63.46,3.3 64.31,2.45 v64.31,1.92
GBUS-TOP1:G-H1-26
  L1/TopSignal 0.254: 46.78,3.03 GBUS-TOP1:G2.32 46.82,3.62 45.84,4.6 45.84,8.77 44.54,10.07 GBUS-TOP1:H1.26
GBUS-TOP1:G-H1-29
  L1/TopSignal 0.254: GBUS-TOP1:H1.29 39.46,12.66 40.7,11.41 42.69,11.41 43.26,10.84 43.26,4.59 44.85,3 GBUS-TOP1:G2.31
GBUS-TOP1:G-H1-33  (via drill 0.18 pad 0.53)
  L1/TopSignal 0.254: GBUS-TOP1:G2.29 73.32,0.86 v73.32,1.93
  L16/BottomSignal 0.254: GBUS-TOP1:H1.33 34.52,12.7 36.03,14.21 72.97,14.21 73.77,13.41 73.77,4.43 73.32,3.99 v73.32,1.93
GBUS-TOP1:G-H1-35  (via drill 0.18 pad 0.53)
  L1/TopSignal 0.254: GBUS-TOP1:G2.28 72.32,0.86 v72.32,1.92
  L14/Power2 0.254: GBUS-TOP1:H1.35 31.94,12.7 34.69,15.45 71.71,15.45 73.72,13.44 73.77,13.44 73.77,4.4 72.29,2.92 72.32,2.89 v72.32,1.92
GBUS-TOP1:G-H1-45  (via drill 0.18 pad 0.53)
  L1/TopSignal 0.254: GBUS-TOP1:G2.47 61.81,3.01 61.81,3.71 61.35,4.17 v61.22,4.17
  L3/Power1 0.254: GBUS-TOP1:H1.45 19.22,12.7 20.63,14.1 60.29,14.1 61.07,13.32 61.07,4.31 v61.22,4.17
GBUS-TOP1:G-H1-47  (via drill 0.18 pad 0.53)
  L1/TopSignal 0.254: GBUS-TOP1:G2.46 60.76,2.94 60.79,2.94 60.79,2.26 60.46,1.93 v60.33,1.93
  L14/Power2 0.254: GBUS-TOP1:H1.47 16.66,12.7 17.94,11.41 19.77,11.41 20.42,10.76 20.42,9.63 21.15,8.9 29.98,8.9 30.6,8.28 30.6,7.07 31.3,6.36 31.5,6.36 31.51,6.36 42.53,6.36 43.25,5.64 43.25,4.6 46.83,1.02 59.47,1.02 60.33,1.87 v60.33,1.93 60.33,2
GBUS-TOP1:G-H1-49  (via drill 0.18 pad 0.53)
  L1/TopSignal 0.254: GBUS-TOP1:G2.30 74.23,0.83 74.33,0.93 v74.33,1.92
  L16/BottomSignal 0.254: GBUS-TOP1:H1.49 14.06,13.08 15.82,14.84 73.55,14.83 75.19,14.83 76.23,13.79 76.23,3.83 74.33,1.94 v74.33,1.92
GBUS-TOP1:G-H2-50  (via drill 0.18 pad 0.53)
  L1/TopSignal 0.254: GBUS-TOP1:G2.60 74.82,2.27 75.29,1.8 v75.29,1.45
  L16/BottomSignal 0.254: GBUS-TOP1:H2.50 14.43,4.71 14.43,3.44 15.48,2.4 15.48,1.29 15.94,0.83 74.66,0.83 v75.28,1.45 v75.29,1.45
GBUS-TOP1:M-3V3-BUS  (via drill 0.18 pad 0.53)
  L1/TopSignal 0.254: GBUS-TOP1:G1.50 31.38,2.96 | GBUS-TOP1:G1.51 32.36,3.05 30.54,3.05 30.59,3.1 v30.59,4.27
  L3/Power1 0.254: 40.7,6.36 33.75,6.36 33.12,5.74 33.13,5.73 33.13,4.37 32.34,3.58 31,3.58 30.59,3.99 v30.59,4.27 | 40.7,6.36 41.96,7.62 GBUS-TOP1:H2.27 | 40.7,6.36 41.98,5.08 GBUS-TOP1:H2.28
  pour L1/TopSignal: 24.09,2.23 32.73,2.23 32.73,3.76 24.13,3.75 24.09,3.75
GBUS-TOP1:M-5V-BUS  (via drill 0.18 pad 0.53)
  L1/TopSignal 0.254: GBUS-TOP1:G1.60 41.49,3.08 v42.07,3.08
  L16/BottomSignal 0.254: GBUS-TOP1:H2.25 GBUS-TOP1:H2.26 42.54,3.08 v42.07,3.08
  pour L1/TopSignal: 33.1,3.75 33.1,2.23 41.73,2.23 41.73,3.75
GBUS-TOP1:M-5V-USB-CHG  (via drill 0.18 pad 0.53)
  L1/TopSignal 0.254: GBUS-TOP1:H1.32 35.68,8.92 26.32,8.92 25.45,8.04 v25.45,4.28 | GBUS-TOP1:G1.13 23.94,0.88 v23.94,1.92
  L3/Power1 0.254: v25.45,4.28 v25.44,4.27 25.44,2.22 25.14,1.92 v23.94,1.92
GBUS-TOP1:M-12V-BUS  (via drill 0.18 pad 0.53)
  L1/TopSignal 0.254: GBUS-TOP1:G2.3 47.32,0.86 v47.32,1.92
  L16/BottomSignal 0.254: GBUS-TOP1:H2.23 GBUS-TOP1:H2.24 47.32,4.84 v47.32,1.92
  pour L1/TopSignal: 47.58,1.56 47.58,0.08 44.96,0.08 44.96,1.56
GBUS-TOP1:M-BATV-BUS  (via drill 0.18 pad 0.53)
  L1/TopSignal 0.254: GBUS-TOP1:G1.8 18.92,0.86 v18.92,1.9 | 17.9,0.86 v17.9,1.9 | 19.91,0.86 v19.91,1.9 | 16.91,0.86 v16.91,1.9 | 20.92,0.83 20.92,1.87 | 21.92,0.83 21.92,1.87
  L16/BottomSignal 0.254: 19,1.9 v18.92,1.9
  L16/BottomSignal 0.762: GBUS-TOP1:H2.45 GBUS-TOP1:H2.46 19.14,2.04 19,1.9
  other vias: 20.92,1.9 21.92,1.9
  pour L1/TopSignal: 14.55,1.55 14.55,0.04 23.17,0.04 23.17,1.55
  pour L16/BottomSignal: 16.34,2.31 22.46,2.31 22.46,1.45 16.34,1.45
GBUS-TOP1:M-SW1-12V  (via drill 0.18 pad 0.53)
  L1/TopSignal 0.254: GBUS-TOP1:G2.23 67.28,0.8 67.33,0.85 | v66.31,1.9 66.26,1.85 GBUS-TOP1:G2.22
  L16/BottomSignal 0.254: GBUS-TOP1:H2.8 66.99,4.67 66.99,3.48 66.31,2.8 v66.31,1.9
  pour L1/TopSignal: 65.95,0.03 67.58,0.03 67.58,1.55 65.95,1.55
GBUS-TOP1:M-SW2-12V  (via drill 0.18 pad 0.53)
  L1/TopSignal 0.254: GBUS-TOP1:G2.21 65.28,0.8 65.31,0.83 65.31,1.6 65.33,1.62 v65.33,1.92
  L16/BottomSignal 0.254: GBUS-TOP1:H2.10 64.83,5.05 64.83,3.45 65.33,2.96 v65.33,1.92
  pour L1/TopSignal: 63.95,0.04 65.58,0.04 65.58,1.56 63.95,1.56
GBUS-TOP1:M-SW3-BAT  (via drill 0.18 pad 0.53)
  L1/TopSignal 0.254: GBUS-TOP1:G2.18 62.33,0.87 v62.33,1.93
  L16/BottomSignal 0.254: GBUS-TOP1:H2.11 62.32,7.32 63.59,6.05 63.59,4.72 64.07,4.24 64.07,3.56 62.43,1.93 v62.33,1.93
  pour L1/TopSignal: 61.96,0.04 63.57,0.04 63.57,1.56 61.95,1.56
GBUS-TOP1:M-SW4-BAT  (via drill 0.18 pad 0.53)
  L1/TopSignal 0.254: GBUS-TOP1:G2.17 61.34,0.88 v61.34,1.92
  L16/BottomSignal 0.254: v61.34,1.92 61.35,1.93 61.35,2.44 62.32,3.41 GBUS-TOP1:H2.12
  pour L1/TopSignal: 59.95,1.56 59.95,0.04 61.58,0.04 61.58,1.56
GBUS-TOP1:M-SW5-5V  (via drill 0.18 pad 0.53)
  L1/TopSignal 0.254: GBUS-TOP1:G2.15 59.33,0.87 v59.33,1.91
  L16/BottomSignal 0.254: GBUS-TOP1:H2.13 59.78,7.27 58.53,6.02 58.53,3.05 59.33,2.25 v59.33,1.91
  pour L1/TopSignal: 57.96,0.04 59.58,0.04 59.58,1.55 57.96,1.55
GBUS-TOP1:M-SW6-5V  (via drill 0.18 pad 0.53)
  L1/TopSignal 0.254: GBUS-TOP1:G2.13 57.31,0.85 57.31,1.6 57.56,1.85 v57.78,1.85 57.62,1.85
  L3/Power1 0.254: GBUS-TOP1:H2.15 57.24,7.25 58.52,5.97 58.52,3.05 57.78,2.31 v57.78,1.85
  pour L1/TopSignal: 55.96,0.03 57.58,0.03 57.58,1.55 55.95,1.55
GBUS-TOP1:M-SW7-5V  (via drill 0.18 pad 0.53)
  L1/TopSignal 0.254: GBUS-TOP1:G2.11 55.33,0.87 v55.33,1.91
  L16/BottomSignal 0.254: GBUS-TOP1:H2.16 57.24,3.76 55.39,1.91 v55.33,1.91
  pour L1/TopSignal: 53.96,0.04 55.57,0.04 55.57,1.55 53.95,1.55
GBUS-TOP1:M-SW8-3V3  (via drill 0.18 pad 0.53)
  L1/TopSignal 0.254: GBUS-TOP1:G2.9 53.33,0.86 v53.33,1.9
  L16/BottomSignal 0.254: GBUS-TOP1:H2.18 54.7,3.2 53.4,1.9 v53.33,1.9
  pour L1/TopSignal: 51.96,0.03 53.58,0.03 53.58,1.55 51.96,1.55
GBUS-TOP1:M-SW9-3V3  (via drill 0.18 pad 0.53)
  L1/TopSignal 0.254: GBUS-TOP1:G2.7 51.33,0.86 v51.33,1.91
  L16/BottomSignal 0.254: GBUS-TOP1:H2.19 52.16,7.25 53.45,5.96 53.45,3.95 51.4,1.91 v51.33,1.91
  pour L1/TopSignal: 49.96,1.55 49.96,0.04 51.57,0.04 51.57,1.55
GBUS-TOP1:M-SW10-3V3  (via drill 0.18 pad 0.53)
  L1/TopSignal 0.254: GBUS-TOP1:G2.5 49.33,0.86 v49.33,1.92
  L16/BottomSignal 0.254: GBUS-TOP1:H2.20 52.16,4.68 49.4,1.92 v49.33,1.92
  pour L1/TopSignal: 47.96,0.04 49.57,0.04 49.57,1.55 47.96,1.55 47.96,1.56 47.96,1.56
GBUS-TOP1:RBF_SW  (via drill 0.18 pad 0.53)
  L1/TopSignal 0.254: v10.97,3.03 11.01,3 GBUS-TOP1:G1.31
  L14/Power2 0.254: GBUS-TOP1:H2.37 GBUS-TOP1:H2.38 27.25,3.03 v10.97,3.03
  pour L1/TopSignal: 12.73,3.77 12.73,1.87 12.34,1.87 12.34,0.11 11.55,0.11 11.55,3.77
GBUS-TOP1:SCLIN  (via drill 0.18 pad 0.53)
  L1/TopSignal 0.254: 62.83,2.98 GBUS-TOP1:G2.48 62.82,3.68 v63.28,4.14
  L3/Power1 0.254: v48.06,6.35 48.32,6.1 48.32,4.37 49.84,2.85 56.14,2.85 56.83,2.16 56.83,1.57 57.28,1.12 58.28,1.12 58.55,1.4 58.55,2.13 59.29,2.87 62.11,2.87 63.28,4.04 v63.28,4.14
  L14/Power2 0.254: GBUS-TOP1:H1.43 23.08,14.1 30.01,14.1 30.56,13.54 30.56,12.01 31.2,11.38 45.07,11.38 45.83,10.62 45.83,6.81 46.29,6.35 v48.06,6.35
GBUS-TOP1:SDAIN  (via drill 0.18 pad 0.53)
  L1/TopSignal 0.254: GBUS-TOP1:G2.49 63.79,2.97 63.79,2.31 63.4,1.92 v63.31,1.92
  L14/Power2 0.254: GBUS-TOP1:H1.41 25.52,11.4 29.9,11.4 30.59,10.72 30.59,9.58 31.28,8.89 42.66,8.89 43.27,8.28 43.27,7.01 43.95,6.33 45.19,6.33 45.83,5.69 45.83,4.24 47.46,2.62 62.8,2.62 63.31,2.1 v63.31,1.92
GBUS-TOP1:SEP_SW1  (via drill 0.18 pad 0.53)
  L1/TopSignal 0.254: GBUS-TOP1:G1.3 13.86,1.58 14.13,1.85 v14.36,1.85
  L3/Power1 0.254: GBUS-TOP1:H2.39 27.99,6.39 27.99,4.24 26.22,2.47 26.22,1.84 25.28,0.91 15.38,0.91 14.43,1.85 v14.36,1.85
GBUS-TOP1:SEP_SW2  (via drill 0.18 pad 0.53)
  L1/TopSignal 0.254: GBUS-TOP1:G1.2 12.86,1.46 13.27,1.87 v13.36,1.87
  L3/Power1 0.254: GBUS-TOP1:H2.40 26.72,5.08 25.47,6.34 20.97,6.34 20.41,5.78 20.41,4.46 19.81,3.86 19.44,3.86 18.55,2.97 14.49,2.97 13.38,1.87 v13.36,1.87 13.36,1.89
GND  (via drill 0.18 pad 0.53)
  L1/TopSignal 0.254: GBUS-TOP1:G2.35 49.62,3 GBUS-TOP1:H2.22 | v22.96,4.21 23.41,3.76 GBUS-TOP1:G1.42 22.95,3 | GBUS-TOP1:G2.24 68.33,0.87 v68.33,1.91
  L1/TopSignal 0.406: GBUS-TOP1:G1.17 41.42,0.8 v42.17,1.55
  pour L1/TopSignal: 48.51,3.75 48.51,2.23 60.13,2.23 60.13,3.75
  pour L1/TopSignal: 24.55,1.56 24.54,0.04 41.18,0.04 41.17,1.56
  pour L1/TopSignal: 15.11,2.24 23.73,2.25 23.73,3.76 15.11,3.75
  pour L2/TopGround: 13.31,94.64 0.38,94.64 0.38,82.7 10.51,82.7 10.51,13.55 1.95,13.55 1.95,0.56 86.86,0.56 86.86,13.36 77.39,13.36 77.39,82.56 87.63,82.56 87.63,94.59 74.79,94.59 74.79,68.92 56.78,68.92 56.78,39.27 66.01,39.27 66.01,20.1 69.83,20.1 69.83,15.97 18.08,15.97 18.08,19.52 22.55,19.52 22.55,38.88 31.71,38.88 31.71,68.92 13.31,68.92
  pour L15/BottomGround: 13.31,94.64 0.38,94.64 0.38,82.7 10.51,82.7 10.51,13.55 1.95,13.55 1.95,0.56 86.86,0.56 86.86,13.36 77.39,13.36 77.39,82.56 87.63,82.56 87.63,94.59 74.79,94.59 74.79,68.92 56.78,68.92 56.78,39.27 66.01,39.27 66.01,20.1 69.83,20.1 69.83,15.97 18.08,15.97 18.08,19.52 22.55,19.52 22.55,38.88 31.71,38.88 31.71,68.92 13.31,68.92

### Text on the board
tPlace: GWU MCAT / SUBSYSTEM / CANYVAL-X